# Altium schematic sheet Zenith_Headers.SchDoc: Zenith_Headers
size Letter; Author: Nicholas J. Sorensen, and Erik F. Halliwell; Engineer: Nicholas J. Sorensen, and Erik F. HalliwellNicholas Sorensen, and Erik Halliwell; DocumentNumber: 8; SheetNumber: 8; SheetTotal: 8
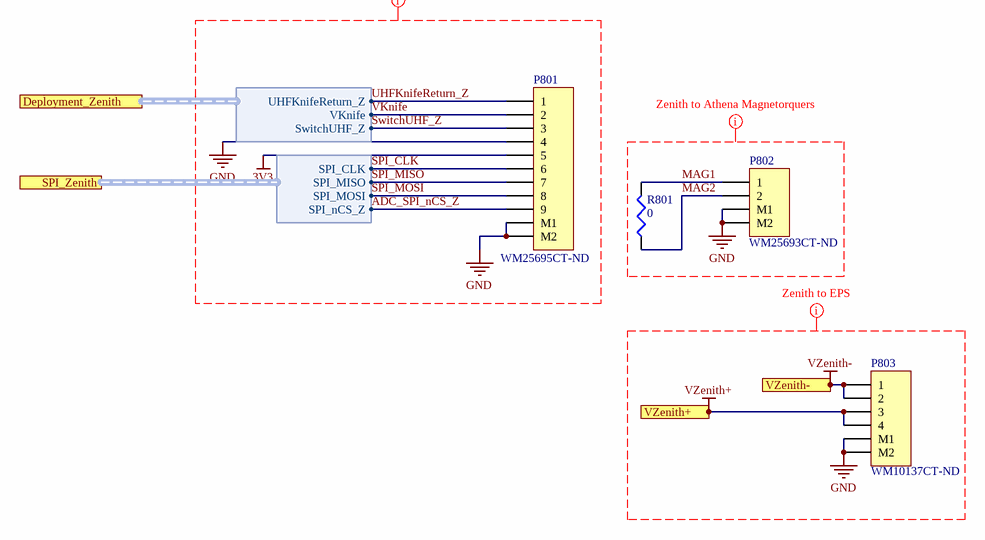
[diagram p0: Zenith_Headers.SchDoc]

## Parts
P801  WM25695CT-ND  [MOLX-5040500991]
P802  WM25693CT-ND  [MOLX-5040500291]
P803  WM10137CT-ND  [MOLX-5040500491]
R801  value 0  [VSH-0805MCU]  (hidden comment: Res3)

## Ports
Deployment_Zenith (harness Deployment_Zenith), SPI_Zenith (harness SPI_Zenith), VZenith+, VZenith-

## Harnesses
Deployment_Zenith: UHFKnifeReturn_Z, VKnife, SwitchUHF_Z
SPI_Zenith: SPI_CLK, SPI_MISO, SPI_MOSI, SPI_nCS_Z

## Nets
3V3: P801.5
GND: P801.4 P801.M1 P801.M2 P802.M1 P802.M2 P803.M1 P803.M2
VZenith+: P803.3 P803.4 ; port VZenith+
VZenith-: P803.1 P803.2 ; port VZenith-
ADC_SPI_nCS_Z: P801.9 ; port SPI_Zenith.SPI_nCS_Z
MAG1: P802.1 R801.2
MAG2: P802.2 R801.1
SPI_CLK: P801.6 ; port SPI_Zenith.SPI_CLK
SPI_MISO: P801.7 ; port SPI_Zenith.SPI_MISO
SPI_MOSI: P801.8 ; port SPI_Zenith.SPI_MOSI
SwitchUHF_Z: P801.3 ; port Deployment_Zenith.SwitchUHF_Z
UHFKnifeReturn_Z: P801.1 ; port Deployment_Zenith.UHFKnifeReturn_Z
VKnife: P801.2 ; port Deployment_Zenith.VKnife

## Layout directives
mark named Zenith to EPS: GND, VZenith+, VZenith-
mark named Zenith to Athena Magnetorquers: GND, MAG1, MAG2
mark named Zenith to Athena Burnwires/SPI: 3V3, ADC_SPI_nCS_Z, GND, SPI_CLK, SPI_MISO, SPI_MOSI, SwitchUHF_Z, UHFKnifeReturn_Z, VKnife

## Notes on the sheet
- (the "License"); you may not use or redistribute this file except in compliance with the License. You
- This file and the information within it are licensed under the terms of the Apache License, Version 2.0
- Copyright
- Unless required by applicable law or agreed to in writing, content distributed under the License is
- distributed on an "AS IS" BASIS, WITHOUT WARRANTIES OR CONDITIONS OF ANY KIND,
- either express or implied. See the License for the specific language governing permissions and
- limitations under the License.
- may obtain a copy of the License at:
- http://www.apache.org/licenses/LICENSE-2.0
- Title
- Size:
- Date:
- Letter
- Number:
- Time:
- Revision:
- Sheet
- of
- University of Alberta
- Deptartment of Electrical
- and Computer Engineering
- Edmonton AB, Canada
- T6G 1H9
- File:

## Library data of the parts
P801 = 68: CONN HEADER SMD R/A 9POS 1.5MM; Part Number: 68; Manufacturer Part Number: 5040500991; Designator: P?; LatestRevisionDate: 17-Jul-2002; LatestRevisionNote: Re-released for DXP Platform.; Publisher: Altium Limited; Supplier Part Number 1: WM25695CT-ND; Supplier 1: Digi-Key; Supplier Link: #https://www.digikey.ca/product-detail/en/molex/5040500991/WM25695CT-ND/9954121#
P802 = 61: CONN HEADER SMD R/A 2POS 1.5MM; Part Number: 61; Manufacturer Part Number: 5040500291; Designator: P?; LatestRevisionDate: 17-Jul-2002; LatestRevisionNote: Re-released for DXP Platform.; Publisher: Altium Limited; Supplier Part Number 1: WM25693CT-ND; Supplier 1: Digi-Key; Supplier Link: #https://www.digikey.ca/product-detail/en/molex/5040500291/WM25693CT-ND/9954119#
P803 = 63: CONN HEADER SMD R/A 4POS 1.5MM; Part Number: 63; Manufacturer Part Number: 5040500491; Designator: P?; LatestRevisionDate: 17-Jul-2002; LatestRevisionNote: Re-released for DXP Platform.; Publisher: Altium Limited; Supplier Part Number 1: WM10137CT-ND; Supplier 1: Digi-Key; Supplier Link: #https://www.digikey.ca/product-detail/en/molex/5040500491/WM10137CT-ND/4357653#
R801 = PR-VSH-00003: RES SMD 0.0 OHM JUMPER 1/5W 0805; Manufacturer Part Number: MCU08050Z0000ZP500; Index: 3; Designator: R?; Published: 3/14/2016; LatestRevisionDate: 3/14/2016; LatestRevisionNote: ...; PackageReference: 0805 (2012 Metric); Publisher: AlbertaSat; PackageDescription: Chip Resistor, 2-Leads, Body 2.00x1.25mm, IPC Low Density; Part Number: PR-VSH-00003; Supplier Part Number 1: MCU0805-0.0-ZZCT-ND; Supplier 1: Digi-key; Supplier Link: http://www.digikey.ca/product-search/en?keywords=MCU0805-0.0-ZZCT-ND; Tolerance: Jumper; Power - Rated: 1/5W; Temperature Coefficient: -; Applications: General Purpose